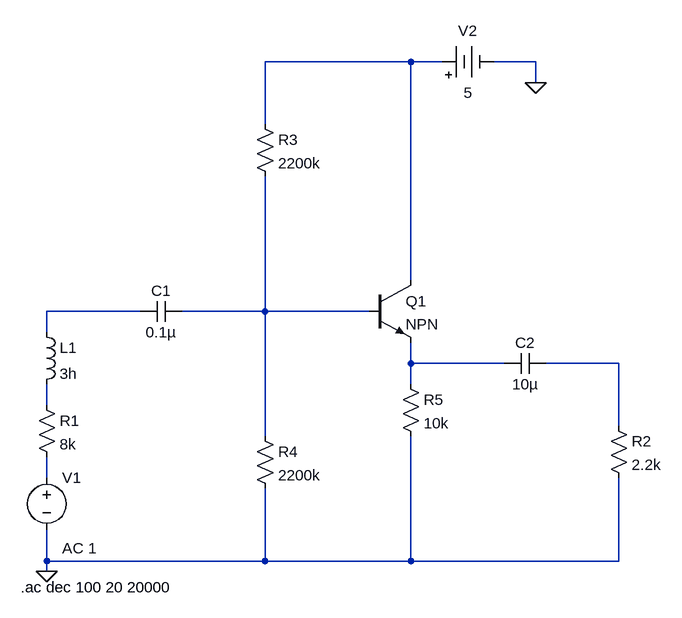
[diagram p0: schematic Buffer.asc]
Buffer.asc, the LTspice schematic file:
Version 4.1
SHEET 1 1144 680
WIRE 688 -416 464 -416
WIRE 736 -416 688 -416
WIRE 880 -416 816 -416
WIRE 880 -384 880 -416
WIRE 464 -320 464 -416
WIRE 688 -80 688 -416
WIRE 272 -32 128 -32
WIRE 464 -32 464 -240
WIRE 464 -32 336 -32
WIRE 624 -32 464 -32
WIRE 128 0 128 -32
WIRE 688 48 688 16
WIRE 832 48 688 48
WIRE 1008 48 896 48
WIRE 688 80 688 48
WIRE 128 112 128 80
WIRE 1008 144 1008 48
WIRE 464 160 464 -32
WIRE 128 224 128 192
WIRE 128 352 128 304
WIRE 464 352 464 240
WIRE 464 352 128 352
WIRE 688 352 688 160
WIRE 688 352 464 352
WIRE 1008 352 1008 224
WIRE 1008 352 688 352
WIRE 128 368 128 352
FLAG 880 -384 0
FLAG 128 368 0
SYMBOL voltage 128 208 R0
WINDOW 123 24 124 Left 2
WINDOW 39 0 0 Left 0
WINDOW 3 24 44 Left 2
SYMATTR Value2 AC 1
SYMATTR InstName V1
SYMATTR Value ""
SYMBOL res 112 96 R0
SYMATTR InstName R1
SYMATTR Value 8k
SYMBOL ind 112 -16 R0
SYMATTR InstName L1
SYMATTR Value 3h
SYMBOL Misc\\battery 720 -416 R270
WINDOW 0 32 56 VTop 2
WINDOW 3 -32 56 VBottom 2
WINDOW 123 0 0 Left 0
WINDOW 39 0 0 Left 0
SYMATTR InstName V2
SYMATTR Value 5
SYMBOL res 448 -336 R0
SYMATTR InstName R3
SYMATTR Value 2200k
SYMBOL res 448 144 R0
SYMATTR InstName R4
SYMATTR Value 2200k
SYMBOL npn 624 -80 R0
SYMATTR InstName Q1
SYMBOL res 672 64 R0
SYMATTR InstName R5
SYMATTR Value 10k
SYMBOL cap 336 -48 R90
WINDOW 0 0 32 VBottom 2
WINDOW 3 32 32 VTop 2
SYMATTR InstName C1
SYMATTR Value 0.1µ
SYMBOL cap 896 32 R90
WINDOW 0 0 32 VBottom 2
WINDOW 3 32 32 VTop 2
SYMATTR InstName C2
SYMATTR Value 10µ
SYMBOL res 992 128 R0
SYMATTR InstName R2
SYMATTR Value 2.2k
TEXT 88 392 Left 2 !.ac dec 100 20 20000

The netlist it stands for:
* Buffer.asc
V1 N007 0 AC 1
R1 N006 N007 8k
L1 N002 N006 3h
V2 N001 0 5
R3 N001 N003 2200k
R4 N003 0 2200k
Q1 N001 N003 N004 0 NPN
R5 N004 0 10k
C1 N003 N002 0.1µ
C2 N005 N004 10µ
R2 N005 0 2.2k
.model NPN NPN
.model PNP PNP
.lib standard.bjt
.ac dec 100 20 20000
.backanno
.end